# EAGLE design SIM_sniffer (EAGLE 6.6.0)
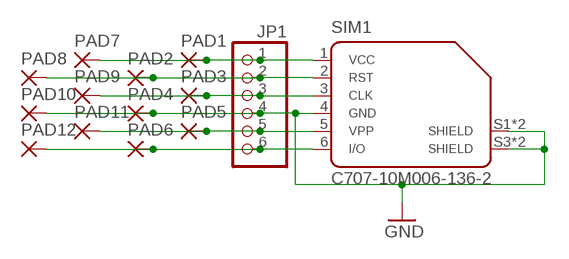
[diagram p0: schematic, sheet 1]

## Parts
JP1  PINHD-1X6  [1X06]
PAD1  SMD2  [SMD1,27-2,54]
PAD2  SMD2  [SMD1,27-2,54]
PAD3  SMD2  [SMD1,27-2,54]
PAD4  SMD2  [SMD1,27-2,54]
PAD5  SMD2  [SMD1,27-2,54]
PAD6  SMD2  [SMD1,27-2,54]
PAD7  SMD2  [SMD1,27-2,54]
PAD8  SMD2  [SMD1,27-2,54]
PAD9  SMD2  [SMD1,27-2,54]
PAD10  SMD2  [SMD1,27-2,54]
PAD11  SMD2  [SMD1,27-2,54]
PAD12  SMD2  [SMD1,27-2,54]
SIM1  C707-10M006-136-2  [C707_10M006_136_2]

## Nets
GND: JP1.4 PAD4.1(P) PAD10.1(P) SIM1.4 SIM1.S1 SIM1.S2(S1) SIM1.S3(S2) SIM1.S4(S2)
N$1: JP1.6 PAD6.1(P) PAD12.1(P) SIM1.6
N$2: JP1.2 PAD2.1(P) PAD8.1(P) SIM1.2
N$3: JP1.3 PAD3.1(P) PAD9.1(P) SIM1.3
N$4: JP1.1 PAD1.1(P) PAD7.1(P) SIM1.1
N$5: JP1.5 PAD5.1(P) PAD11.1(P) SIM1.5

## Library data of the parts
JP1 = pinhead:PINHD-1X6: PIN HEADER
PAD1-PAD12 = wirepad:SMD2: SMD PAD
SIM1 = con-amphenol:C707-10M006-136-2

## Board
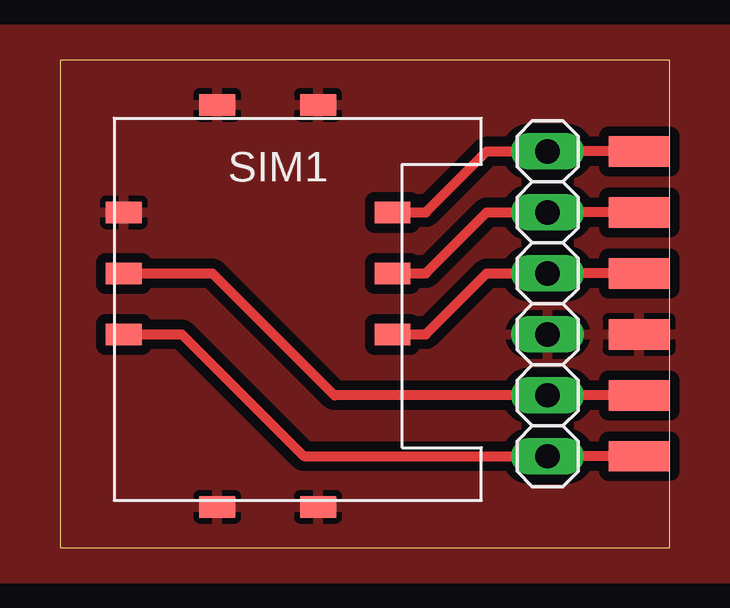
[diagram p1: board, top side]
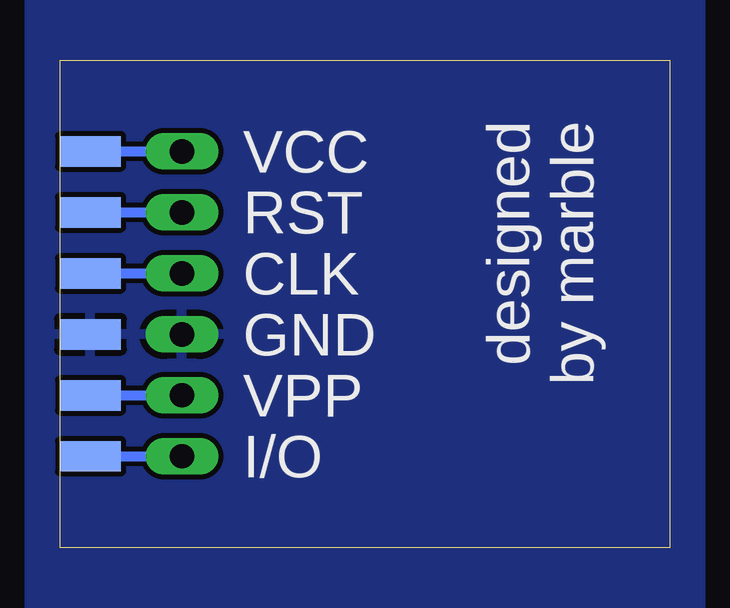
[diagram p2: board, bottom side, seen from below]

Size 25.4 x 20.32 mm. Coordinates in mm from the lower left corner, seen from the top.
Outline: 0,0 25.4,0 25.4,20.32 0,20.32 0,0
Copper layers (1*16): Top 0.035mm / dielectric 1.5mm / Bottom 0.035mm
Design rules "default *": minimum track width 10mil, minimum drill 24mil, track to track 8mil, track to pad 8mil, pad to pad 8mil, via to via 8mil, smd to smd 8mil, copper to edge 0mil, drill to drill 8mil, minimum pad ring 10mil, minimum via ring 8mil, stop-mask expansion 4mil, vias tented up to drill 0mil, thermal gap 10mil

### Footprints (pad centres in the part's own frame; a part is rotated, then mirrored left to right if it is on the bottom)
1X06 = drill 1.016 long: 1 -6.35,0; 2 -3.81,0; 3 -1.27,0; 4 1.27,0; 5 3.81,0; 6 6.35,0
SMD1,27-2,54 = smd 1.27 x 2.54: 1 0,0
C707_10M006_136_2 = smd 1.49 x 0.9: 1 4.965,2.54; 2 4.965,0; 3 4.965,-2.54; 4 -6.235,2.54; 5 -6.235,0; 6 -6.235,-2.54; S1 -2.335,7.02; S2 1.865,7.02; S3 -2.335,-9.73; S4 1.865,-9.73

### Placement (x,y rotation side)
JP1  20.32,10.16 270 top
PAD1  24.13,16.51 90 top
PAD2  24.13,13.97 90 top
PAD3  24.13,11.43 90 top
PAD4  24.13,8.89 90 top
PAD5  24.13,6.35 90 top
PAD6  24.13,3.81 90 top
PAD7  24.13,16.51 270 bottom
PAD8  24.13,13.97 270 bottom
PAD9  24.13,11.43 90 bottom
PAD10  24.13,8.89 90 bottom
PAD11  24.13,6.35 270 bottom
PAD12  24.13,3.81 270 bottom
SIM1  8.89,11.43 0 top

### Tracks (layer width: path | path; a pad name or v marks a point on that pad's centre or on a via)
GND
  pour Top (isolate 0.406): -2.54,-1.27 27.94,-1.27 27.94,21.59 -2.54,21.59
  pour Bottom: -1.27,-2.54 26.67,-2.54 26.67,22.86 -1.27,22.86
N$1
  Top 0.406: SIM1.6 5.08,8.89 10.16,3.81 JP1.6 PAD12.1
  Bottom 0.406: PAD12.1 JP1.6
N$2
  Top 0.406: SIM1.2 15.24,11.43 17.78,13.97 JP1.2 PAD8.1
  Bottom 0.406: PAD8.1 JP1.2
N$3
  Top 0.406: SIM1.3 15.24,8.89 17.78,11.43 JP1.3 PAD9.1
  Bottom 0.406: PAD9.1 JP1.3
N$4
  Top 0.406: SIM1.1 15.24,13.97 17.78,16.51 JP1.1 PAD1.1
  Bottom 0.406: PAD1.1 JP1.1
N$5
  Top 0.406: SIM1.5 6.35,11.43 11.43,6.35 JP1.5 PAD11.1
  Bottom 0.406: PAD11.1 JP1.5

### Text on the board
bNames: designed / by marble | VCC | RST | CLK | GND | VPP | I/O